# EAGLE schematic iPad_adapt_board (EAGLE 6.5.0)
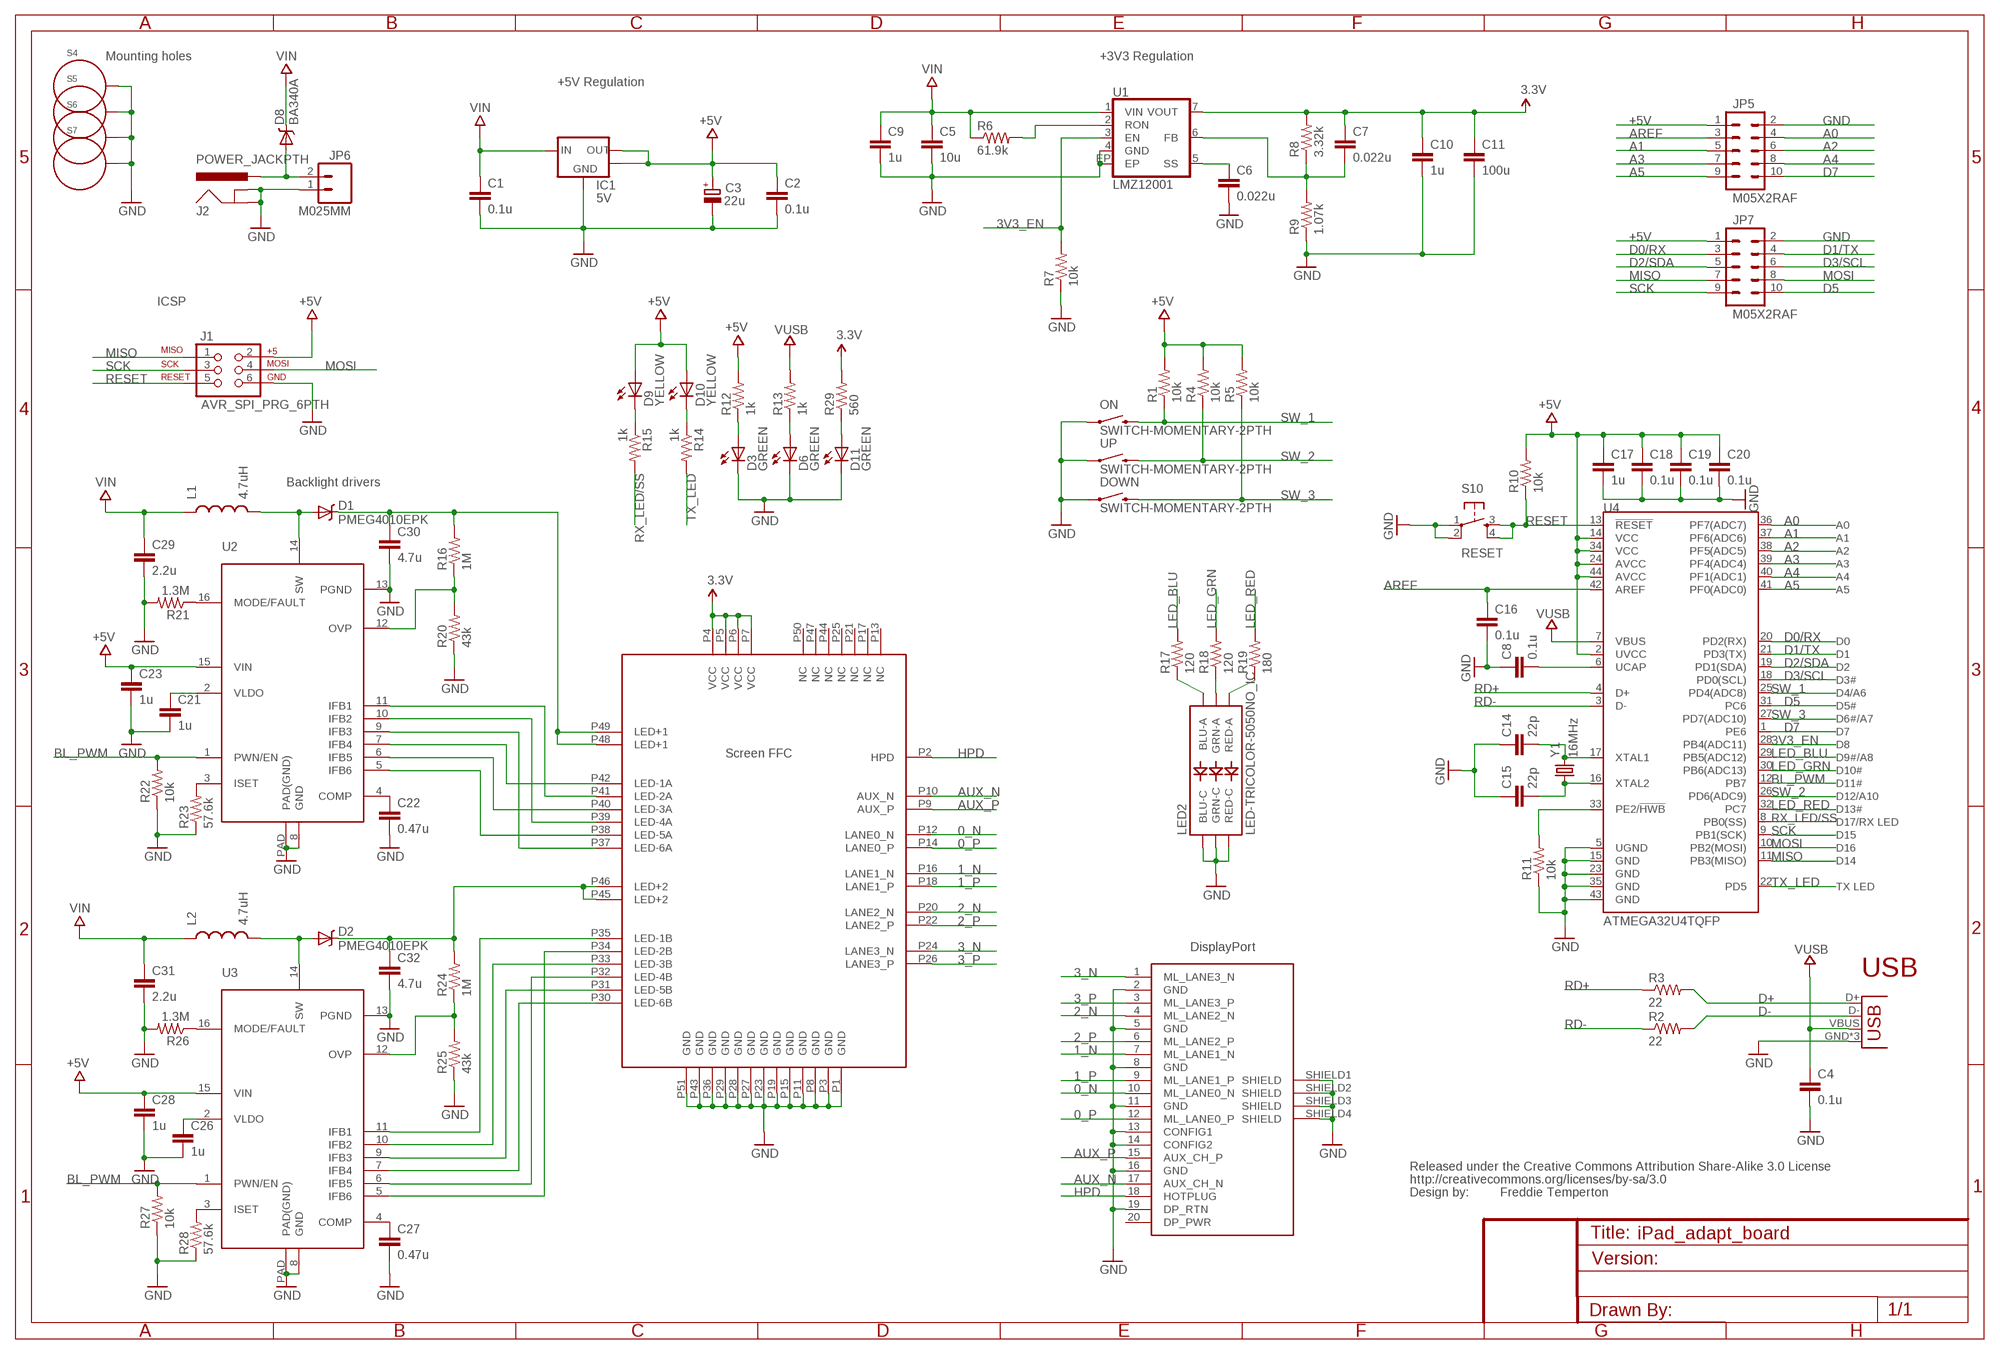
[diagram p0: schematic, sheet 1]

## Parts
C1  0.1u  CAP0603-CAP  [0603-CAP]
C2  0.1u  CAP0603-CAP  [0603-CAP]
C3  22u  CPOL-EUSMCB  [SMC_B]
C4  0.1u  CAP0603-CAP  [0603-CAP]
C5  10u  CAP1206  [1206]
C6  0.022u  CAP0603-CAP  [0603-CAP]
C7  0.022u  CAP0603-CAP  [0603-CAP]
C8  0.1u  CAP0603-CAP  [0603-CAP]
C9  1u  CAP1206  [1206]
C10  1u  CAP1206  [1206]
C11  100u  C-EUC1210  [C1210]
C14  22p  CAP0603-CAP  [0603-CAP]
C15  22p  CAP0603-CAP  [0603-CAP]
C16  0.1u  CAP0603-CAP  [0603-CAP]
C17  1u  CAP0603-CAP  [0603-CAP]
C18  0.1u  CAP0603-CAP  [0603-CAP]
C19  0.1u  CAP0603-CAP  [0603-CAP]
C20  0.1u  CAP0603-CAP  [0603-CAP]
C21  1u  CAP0603-CAP  [0603-CAP]
C22  0.47u  CAP0603-CAP  [0603-CAP]
C23  1u  CAP0603-CAP  [0603-CAP]
C26  1u  CAP0603-CAP  [0603-CAP]
C27  0.47u  CAP0603-CAP  [0603-CAP]
C28  1u  CAP0603-CAP  [0603-CAP]
C29  2.2u  CAP0805  [0805]
C30  4.7u  CAP0805  [0805]
C31  2.2u  CAP0805  [0805]
C32  4.7u  CAP0805  [0805]
CC_TEXT1  CREATIVE_COMMONS  [CREATIVE_COMMONS]
D1  PMEG4010EPK  [SOD1608]
D2  PMEG4010EPK  [SOD1608]
D3  GREEN  LED-GREEN0603  [LED-0603]
D6  GREEN  LED-GREEN0603  [LED-0603]
D8  BA340A  B340A  [SMA-DIODE]
D9  YELLOW  LED-YELLOW0603  [LED-0603]
D10  YELLOW  LED-YELLOW0603  [LED-0603]
D11  GREEN  LED-GREEN0603  [LED-0603]
DOWN  SWITCH-MOMENTARY-2PTH  [TACTILE-PTH]
IC1  5V  V_REG_LM1117SOT223  [SOT223]
J1  AVR_SPI_PRG_6PTH  [2X3]
J2  POWER_JACKPTH  [POWER_JACK_PTH]
J3  DP  [DP]
J4  IPAD3-CONN  [MOLEX502250-5191]
JP1  USB-MICROB  [USB-MICROB]
JP5  M05X2RAF  [2X5-RAF]
JP6  M025MM  [SCREWTERMINAL-5MM-2]
JP7  M05X2RAF  [2X5-RAF]
L1  4.7uH  INDUCTORBOURNS_SRN6045  [SRN6045]
L2  4.7uH  INDUCTORBOURNS_SRN6045  [SRN6045]
LED2  LED-TRICOLOR-5050NO_IC  [LED-TRICOLOR-5050]
ON  SWITCH-MOMENTARY-2PTH  [TACTILE-PTH]
R1  10k  RESISTOR0603-RES  [0603-RES]
R2  22  RESISTOR0603-RES  [0603-RES]
R3  22  RESISTOR0603-RES  [0603-RES]
R4  10k  RESISTOR0603-RES  [0603-RES]
R5  10k  RESISTOR0603-RES  [0603-RES]
R6  61.9k  RESISTOR0603-RES  [0603-RES]
R7  10k  RESISTOR0603-RES  [0603-RES]
R8  3.32k  RESISTOR0603-RES  [0603-RES]
R9  1.07k  RESISTOR0603-RES  [0603-RES]
R10  10k  RESISTOR0603-RES  [0603-RES]
R11  10k  RESISTOR0603-RES  [0603-RES]
R12  1k  RESISTOR0603-RES  [0603-RES]
R13  1k  RESISTOR0603-RES  [0603-RES]
R14  1k  RESISTOR0603-RES  [0603-RES]
R15  1k  RESISTOR0603-RES  [0603-RES]
R16  1M  RESISTOR0603-RES  [0603-RES]
R17  120  RESISTOR0603-RES  [0603-RES]
R18  120  RESISTOR0603-RES  [0603-RES]
R19  180  RESISTOR0603-RES  [0603-RES]
R20  43k  RESISTOR0603-RES  [0603-RES]
R21  1.3M  RESISTOR0603-RES  [0603-RES]
R22  10k  RESISTOR0603-RES  [0603-RES]
R23  57.6k  RESISTOR0603-RES  [0603-RES]
R24  1M  RESISTOR0603-RES  [0603-RES]
R25  43k  RESISTOR0603-RES  [0603-RES]
R26  1.3M  RESISTOR0603-RES  [0603-RES]
R27  10k  RESISTOR0603-RES  [0603-RES]
R28  57.6k  RESISTOR0603-RES  [0603-RES]
R29  560  RESISTOR0603-RES  [0603-RES]
S4  STANDOFF_ELECTRICAL  [STANDOFF-ELECTRICAL]
S5  STANDOFF_ELECTRICAL  [STANDOFF-ELECTRICAL]
S6  STANDOFF_ELECTRICAL  [STANDOFF-ELECTRICAL]
S7  STANDOFF_ELECTRICAL  [STANDOFF-ELECTRICAL]
S10  RESET  TAC_SWITCHSMD  [TACTILE_SWITCH_SMD]
U1  LMZ12001  LMZ14203  [TO-PMOD-7]
U2  TPS61176  [QFN16]
U3  TPS61176  [QFN16]
U4  ATMEGA32U4TQFP  [SPARKFUN-DIGITALIC_TQFP44]
UP  SWITCH-MOMENTARY-2PTH  [TACTILE-PTH]
Y1  16MHz  CRYSTALTXC-7A  [CRYSTAL-TXC-7A]

## Nets
0_N: J3.10(ML_LANE0_N) J4.P12(LANE0_N)
0_P: J3.12(ML_LANE0_P) J4.P14(LANE0_P)
1_N: J3.7(ML_LANE1_N) J4.P16(LANE1_N)
1_P: J3.9(ML_LANE1_P) J4.P18(LANE1_P)
2_N: J3.4(ML_LANE2_N) J4.P20(LANE2_N)
2_P: J3.6(ML_LANE2_P) J4.P22(LANE2_P)
3.3V: C7.1 C10.1 C11.1 J4.P4(VCC) J4.P5(VCC) J4.P6(VCC) J4.P7(VCC) R8.2 R29.2 U1.7(VOUT)
3_N: J3.1(ML_LANE3_N) J4.P24(LANE3_N)
3_P: J3.3(ML_LANE3_P) J4.P26(LANE3_P)
3V3_EN: R7.2 U1.3(EN) U4.28(PB4(ADC11))
+5V: C2.1 C3.+ C17.1 C18.1 C19.1 C20.1 C23.1 C28.1 D9.A D10.A IC1.2(OUT) IC1.4(OUT) J1.2 JP5.1 JP7.1 R1.2 R4.2 R5.2 R10.2 R12.2 U2.15(VIN) U3.15(VIN) U4.2(UVCC) U4.14(VCC) U4.24(AVCC) U4.34(VCC) U4.44(AVCC)
A0: JP5.4 U4.36(PF7(ADC7))
A1: JP5.5 U4.37(PF6(ADC6))
A2: JP5.6 U4.38(PF5(ADC5))
A3: JP5.7 U4.39(PF4(ADC4))
A4: JP5.8 U4.40(PF1(ADC1))
A5: JP5.9 U4.41(PF0(ADC0))
AREF: C16.1 JP5.3 U4.42(AREF)
AUX_N: J3.17(AUX_CH_N) J4.P10(AUX_N)
AUX_P: J3.15(AUX_CH_P) J4.P9(AUX_P)
BL_PWM: R22.2 R27.2 U2.1(PWN/EN) U3.1(PWN/EN) U4.12(PB7)
D0/RX: JP7.3 U4.20(PD2(RX))
D1/TX: JP7.4 U4.21(PD3(TX))
D2/SDA: JP7.5 U4.19(PD1(SDA))
D3/SCL: JP7.6 U4.18(PD0(SCL))
D5: JP7.10 U4.31(PC6)
D7: JP5.10 U4.1(PE6)
D+: JP1.D+ R3.2
D-: JP1.D- R2.2
GND: C1.2 C2.2 C3.- C4.2 C5.2 C6.2 C8.1 C9.2 C10.2 C11.2 C14.1 C15.1 C16.2 C17.2 C18.2 C19.2 C20.2 C21.2 C22.2 C23.2 C26.2 C27.2 C28.2 C29.2 C30.2 C31.2 C32.2 D3.C D6.C D11.C DOWN.1 IC1.1(ADJ) J1.6 J2.GND J2.GNDBREAK J3.2(GND) J3.5(GND) J3.8(GND) J3.11(GND) J3.13(CONFIG1) J3.14(CONFIG2) J3.16(GND) J3.19(DP_RTN) J3.SHIELD1(SHIELD) J3.SHIELD2(SHIELD) J3.SHIELD3(SHIELD) J3.SHIELD4(SHIELD) J4.P1(GND) J4.P3(GND) J4.P8(GND) J4.P11(GND) J4.P15(GND) J4.P19(GND) J4.P23(GND) J4.P27(GND) J4.P28(GND) J4.P29(GND) J4.P36(GND) J4.P43(GND) J4.P51(GND) JP1.GND JP1.MT1(GND) JP1.MT2(GND) JP5.2 JP6.1 JP7.2 LED2.4(BLU-C) LED2.5(RED-C) LED2.6(GRN-C) ON.1 R7.1 R9.1 R11.1 R20.1 R21.2 R22.1 R23.1 R25.1 R26.2 R27.1 R28.1 S4.P1 S5.P1 S6.P1 S7.P1 S10.1 S10.2 U1.4(GND) U1.EP U2.8(GND) U2.13(PGND) U2.PAD(PAD(GND)) U3.8(GND) U3.13(PGND) U3.PAD(PAD(GND)) U4.5(UGND) U4.15(GND) U4.23(GND) U4.35(GND) U4.43(GND) UP.1
HPD: J3.18(HOTPLUG) J4.P2(HPD)
LED_BLU: R17.2 U4.29(PB5(ADC12))
LED_GRN: R18.2 U4.30(PB6(ADC13))
LED_RED: R19.2 U4.32(PC7)
MISO: J1.1 JP7.7 U4.11(PB3(MISO))
MOSI: J1.4 JP7.8 U4.10(PB2(MOSI))
N$1: C6.1 U1.5(SS)
N$2: R6.2 U1.2(RON)
N$3: C7.2 R8.1 R9.2 U1.6(FB)
N$4: J4.P41(LED-2A) U2.11(IFB1)
N$5: C8.2 U4.6(UCAP)
N$6: C14.2 U4.17(XTAL1) Y1.P$2
N$7: J4.P39(LED-4A) U2.10(IFB2)
N$8: C15.2 U4.16(XTAL2) Y1.P$1
N$9: D3.A R12.1
N$10: D6.A R13.1
N$11: R11.2 U4.33(PE2/!HWB)
N$12: LED2.1(GRN-A) R18.1
N$13: D10.C R14.1
N$14: D9.C R15.1
N$15: R21.1 U2.16(MODE/FAULT)
N$16: LED2.3(BLU-A) R17.1
N$17: LED2.2(RED-A) R19.1
N$18: D1.A L1.2 U2.14(SW)
N$19: C30.1 D1.C J4.P48(LED+1) J4.P49(LED+1) R16.2
N$20: R16.1 R20.2 U2.12(OVP)
N$21: J4.P37(LED-6A) U2.9(IFB3)
N$22: C22.1 U2.4(COMP)
N$23: R23.2 U2.3(ISET)
N$24: J4.P42(LED-1A) U2.7(IFB4)
N$25: C21.1 U2.2(VLDO)
N$26: J4.P40(LED-3A) U2.6(IFB5)
N$27: J4.P38(LED-5A) U2.5(IFB6)
N$28: R26.1 U3.16(MODE/FAULT)
N$29: D2.A L2.2 U3.14(SW)
N$30: J4.P35(LED-1B) U3.11(IFB1)
N$31: R24.1 R25.2 U3.12(OVP)
N$32: C27.1 U3.4(COMP)
N$33: R28.2 U3.3(ISET)
N$34: C26.1 U3.2(VLDO)
N$35: J4.P33(LED-3B) U3.10(IFB2)
N$36: J4.P31(LED-5B) U3.9(IFB3)
N$38: J4.P32(LED-4B) U3.6(IFB5)
N$39: J4.P34(LED-2B) U3.5(IFB6)
N$40: D11.A R29.1
N$41: C32.1 D2.C J4.P45(LED+2) J4.P46(LED+2) R24.2
N$42: D8.A J2.PWR JP6.2
N$44: J4.P30(LED-6B) U3.7(IFB4)
RD+: R3.1 U4.4(D+)
RD-: R2.1 U4.3(D-)
RESET: J1.5 R10.1 S10.3 S10.4 U4.13(!RESET)
RX_LED/SS: R15.2 U4.8(PB0(SS))
SCK: J1.3 JP7.9 U4.9(PB1(SCK))
SW_1: ON.3 R1.1 U4.25(PD4(ADC8))
SW_2: R4.1 U4.26(PD6(ADC9)) UP.3
SW_3: DOWN.3 R5.1 U4.27(PD7(ADC10))
TX_LED: R14.2 U4.22(PD5)
VIN: C1.1 C5.1 C9.1 C29.1 C31.1 D8.C IC1.3(IN) L1.1 L2.1 R6.1 U1.1(VIN)
VUSB: C4.1 JP1.VBUS R13.2 U4.7(VBUS)
Unconnected: J3.20(DP_PWR) J4.P13(NC) J4.P17(NC) J4.P21(NC) J4.P25(NC) J4.P44(NC) J4.P47(NC) J4.P50(NC)

## Notes on the sheet
- Mounting holes | +3V3 Regulation
- +5V Regulation
- ICSP
- Backlight drivers
- Screen FFC
- DisplayPort
- USB
- Freddie Temperton

## Library data of the parts
C1 C2 C4 C6-C8 C14-C23 C26-C28 = SparkFun-Passives:CAP: Capacitor Standard 0603 ceramic capacitor, and 0.1" leaded capacitor.
C3 = rcl:CPOL-EU: POLARIZED CAPACITOR, European symbol
C5 C9 C10 C29-C32 = SparkFun-Capacitors:CAP: Capacitor Standard 0603 ceramic capacitor, and 0.1" leaded capacitor.
C11 = rcl:C-EU: CAPACITOR, European symbol
CC_TEXT1 = SparkFun-Aesthetics:CREATIVE_COMMONS: Creative Commons License summary
D1 D2 = iPad_adap:PMEG4010EPK
D3 D6 D11 = SparkFun-LED:LED-GREEN: Various green LEDs 0603- DIO-00821 LARGE- DIO-00862 LILYPAD- DIO-09910; PROD_ID: DIO-00821
D8 = SparkFun-DiscreteSemi:B340A: Schottky Diode 3A-40V; PROD_ID: DIO-09886
D9 D10 = SparkFun-LED:LED-YELLOW: Yellow SMD LEDs LilyPad 1206- DIO-09909 0603- DIO-09003; PROD_ID: DIO-09003
DOWN ON UP = SparkFun-Electromechanical:SWITCH-MOMENTARY-2: Various NO switches- pushbuttons, reed, etc
IC1 = SparkFun-PowerIC:V_REG_LM1117: Voltage Regulator LM1117 Standard adjustable voltage regulator but in SMD form. Spark Fun Electronics SKU : COM-00595
J1 = SparkFun-Connectors:AVR_SPI_PRG_6: AVR ISP 6 Pin This is the reduced ISP connector for AVR programming. Common on Arduino. This footprint will take up less PCB space and can be used with a 10-pin to 6-pin adapter such as SKU: BOB-08508
J2 = SparkFun-Connectors:POWER_JACK: Power Jack This is the standard 5.5mm barrel jack for power. The PTH is the most common, proven, reliable, footprint. The Slot footprint only works if the mill layer is transmitted to the PCB fab house so be warned. Spark Fun Electronics SKU : PRT-00119 SMT: CONN-08106 Mating wall wart : TOL-00298 (and others)
J3 = iPad_adap:DP
J4 = con-ipad3:IPAD3-CONN
JP1 = SparkFun-Connectors:USB: USB Connectors USB-B-PTH is fully proven SKU : PRT-00139/CONN-08278 USB-miniB is fully proven SKU : PRT-00587 USB-A-PCB is untested. USB-A-H is throughly reviewed, but untested. Spark Fun Electronics SKU : PRT-00437 USB-B-SMT is throughly reviewed, but untested. Needs silkscreen touching up. USB-A-S has not been used/tested USB-MB-H has not been used/tested USB-MICROB has been used. CONN-09505; PROD_ID: CONN-09505
JP5 JP7 = SparkFun-Connectors:M05X2: Header 5x2 Standard 10-pin dual row 0.1" header. Commonly used with AVR-ISP. Use with Spark Fun Electronics SKU: PRT-00778
JP6 = SparkFun-Connectors:M02: Standard 2-pin 0.1" header. Use with - straight break away headers ( PRT-00116) - right angle break away headers (PRT-00553) - swiss pins (PRT-00743) - machine pins (PRT-00117) - female headers (PRT-00115) Molex polarized connector foot print use with: PRT-08233 with associated crimp pins and housings. 2.54_SCREWTERM for use with PRT-10571. 3.5mm Screw Terminal footprints for PRT-08084 5mm Screw Terminal footprints for use with PRT-08433
L1 L2 = SparkFun-Passives:INDUCTOR: Inductors Basic Inductor/Choke - 0603 and 1206. Footprints are not proven and vary greatly between part numbers. SRN6045- 33uH, 20% 1.4A SDR0403-560KL - 56uH, 10%, 500mA RMS/740mA peak; PROD_ID: NDUC-11627; VALUE: 33uH
LED2 = SparkFun-LED:LED-TRICOLOR-5050
R1-R29 = SparkFun-Passives:RESISTOR: Resistor Basic schematic elements and footprints for 0603, 1206, and PTH resistors.
S4-S7 = SparkFun-Electromechanical:STANDOFF_ELECTRICAL: A standoff intended to be an electrically connected point. Pad size and stop size allow for a #4 Phillips pan screw head to make a solid connection to the board.
S10 = SparkFun-Electromechanical:TAC_SWITCH: Momentary Switch Button commonly used for reset or general input. Spark Fun Electronics SKU : COM-00097 SMT- SWCH-08247; PROD_ID: SWCH-08247
U1 = SparkFun-PowerIC:LMZ14203: 3A, Simple Switcher Power Module with 42V Maximum Input
U2 U3 = iPad_adap:TPS61176
U4 = SparkFun-DigitalIC:ATMEGA32U4: Atmel 44-pin 8-bit Microcontroller with 32KBytes of ISP Flash and USB Controller ----- Please use the QFN-44-NOPAD_1:1 package for the footprint of all boards using a 32U4. Route traces directly away from the pads as much as possible.
Y1 = SparkFun-FreqCtrl:CRYSTAL: Various standard crystals. Proven footprints. Spark Fun Electronics SKU : COM-00534